# Altium schematic sheet Overview.SchDoc
size A4; SheetNumber: 1; SheetTotal: 7
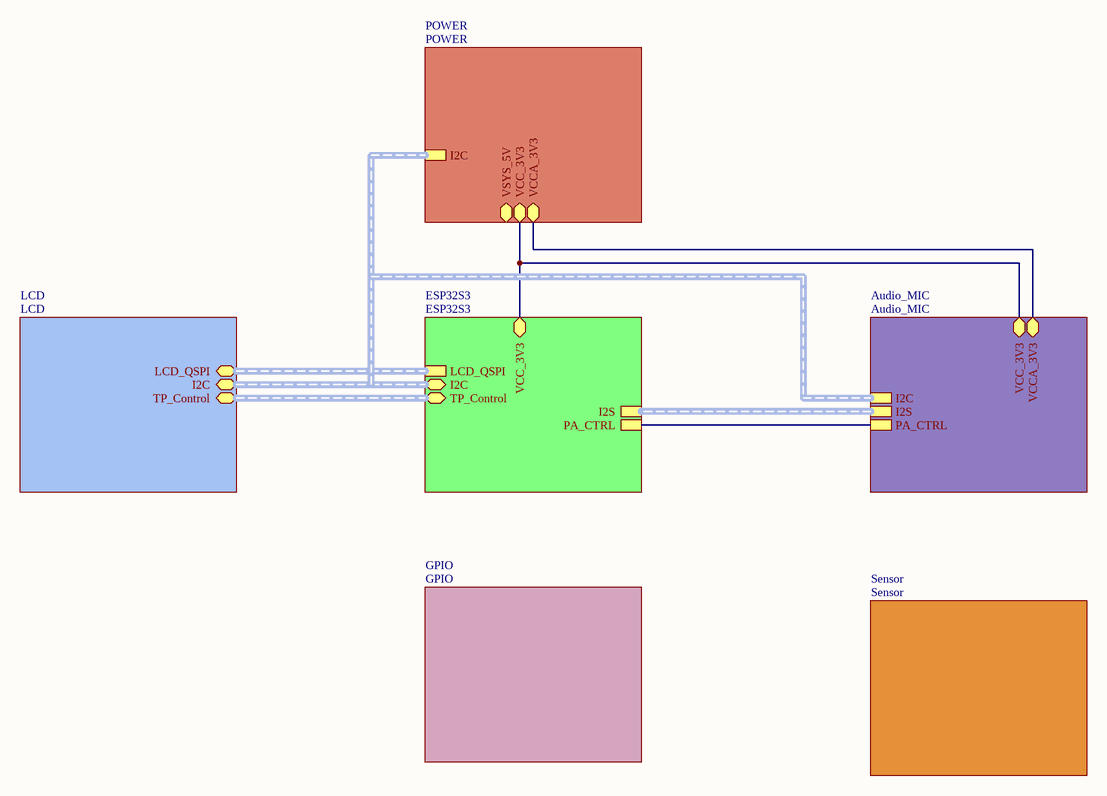
[diagram p0: Overview.SchDoc]

## Sub-sheets
Audio_MIC = Audio_MIC: VCCA_3V3 (bidir), VCC_3V3 (bidir), I2C, I2S, PA_CTRL
ESP32S3 = ESP32S3: LCD_QSPI, I2C (bidir), TP_Control (bidir), VCC_3V3 (bidir), I2S, PA_CTRL
GPIO = GPIO: no entries
LCD = LCD: LCD_QSPI (bidir), I2C (bidir), TP_Control (bidir)
POWER = POWER: I2C, VSYS_5V (bidir), VCC_3V3 (bidir), VCCA_3V3 (bidir)
Sensor = Sensor: no entries

## Nets
(unnamed): sheet ESP32S3/VCC_3V3, sheet POWER/VCC_3V3, sheet Audio_MIC/VCC_3V3
(unnamed): sheet ESP32S3/PA_CTRL, sheet Audio_MIC/PA_CTRL
(unnamed): sheet POWER/VCCA_3V3, sheet Audio_MIC/VCCA_3V3

## Buses and harness runs
harness sheet Audio_MIC/I2C = sheet ESP32S3/I2C = sheet LCD/I2C = sheet POWER/I2C
harness sheet Audio_MIC/I2S = sheet ESP32S3/I2S
harness sheet ESP32S3/LCD_QSPI = sheet LCD/LCD_QSPI
harness sheet ESP32S3/TP_Control = sheet LCD/TP_Control